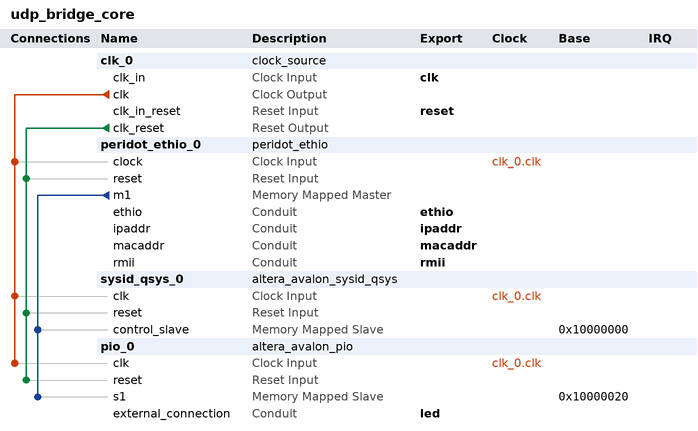
[diagram p0: system contents]
# Platform Designer (Qsys) system udp_bridge_core, Cyclone IV E EP4CE6E22C8
# Parameters at their usual value, and those the tool derives, are not listed.
package require -exact qsys 22.1
create_system udp_bridge_core
set_project_property DEVICE_FAMILY {Cyclone IV E}
set_project_property DEVICE EP4CE6E22C8

add_instance clk_0 clock_source 22.1
set_instance_parameter_value clk_0 clockFrequency 50000000

add_instance peridot_ethio_0 peridot_ethio 20.1
set_instance_parameter_value peridot_ethio_0 AVALONMM_FASTMODE 0
set_instance_parameter_value peridot_ethio_0 ENABLE_UDP_CHECKSUM 1
set_instance_parameter_value peridot_ethio_0 IGNORE_RXFCS_CHECK 0
set_instance_parameter_value peridot_ethio_0 IPADDR_VALUE 192.168.1.114
set_instance_parameter_value peridot_ethio_0 MACADDR_VALUE 280375448305665
set_instance_parameter_value peridot_ethio_0 MTU_SIZE 1500
set_instance_parameter_value peridot_ethio_0 PART_NAME EP4CE6E22C8
set_instance_parameter_value peridot_ethio_0 PAUSEFRAME_VALUE 65535
set_instance_parameter_value peridot_ethio_0 PAUSELESS_VALUE 0
set_instance_parameter_value peridot_ethio_0 RXFIFO_SIZE 4096
set_instance_parameter_value peridot_ethio_0 SINKFIFO_0_SIZE 2048
set_instance_parameter_value peridot_ethio_0 SINKFIFO_1_SIZE 2048
set_instance_parameter_value peridot_ethio_0 SINKFIFO_2_SIZE 2048
set_instance_parameter_value peridot_ethio_0 SINKFIFO_3_SIZE 2048
set_instance_parameter_value peridot_ethio_0 SINKFIFO_NUMBER 1
set_instance_parameter_value peridot_ethio_0 SRCFIFO_0_SIZE 2048
set_instance_parameter_value peridot_ethio_0 SRCFIFO_1_SIZE 2048
set_instance_parameter_value peridot_ethio_0 SRCFIFO_2_SIZE 2048
set_instance_parameter_value peridot_ethio_0 SRCFIFO_3_SIZE 2048
set_instance_parameter_value peridot_ethio_0 SRCFIFO_NUMBER 1
set_instance_parameter_value peridot_ethio_0 SUPPORT_HARFDUPLEX 0
set_instance_parameter_value peridot_ethio_0 SUPPORT_MEMORYHOST 1
set_instance_parameter_value peridot_ethio_0 SUPPORT_PAUSEFRAME 0
set_instance_parameter_value peridot_ethio_0 SUPPORT_SPEED_10M 0
set_instance_parameter_value peridot_ethio_0 SUPPORT_STREAMFIFO 0
set_instance_parameter_value peridot_ethio_0 TXFIFO_SIZE 4096
set_instance_parameter_value peridot_ethio_0 UDPPORT_VALUE 16241
set_instance_parameter_value peridot_ethio_0 USE_FIXED_IPADDR false
set_instance_parameter_value peridot_ethio_0 USE_FIXED_MACADDR false
set_instance_parameter_value peridot_ethio_0 USE_FIXED_PAUSE true
set_instance_parameter_value peridot_ethio_0 USE_FIXED_UDPPORT true

add_instance sysid_qsys_0 altera_avalon_sysid_qsys 22.1
set_instance_parameter_value sysid_qsys_0 id 1923088386

add_instance pio_0 altera_avalon_pio 22.1
set_instance_parameter_value pio_0 direction Output
set_instance_parameter_value pio_0 width 2

# connections
add_connection clk_0.clk peridot_ethio_0.clock clock
add_connection clk_0.clk pio_0.clk clock
add_connection clk_0.clk sysid_qsys_0.clk clock
add_connection clk_0.clk_reset peridot_ethio_0.reset reset
add_connection clk_0.clk_reset pio_0.reset reset
add_connection clk_0.clk_reset sysid_qsys_0.reset reset
add_connection peridot_ethio_0.m1 pio_0.s1 avalon
set_connection_parameter_value peridot_ethio_0.m1/pio_0.s1 baseAddress 0x10000020
add_connection peridot_ethio_0.m1 sysid_qsys_0.control_slave avalon
set_connection_parameter_value peridot_ethio_0.m1/sysid_qsys_0.control_slave baseAddress 0x10000000

# exported interfaces
add_interface clk clock sink
set_interface_property clk EXPORT_OF clk_0.clk_in
add_interface ethio conduit end
set_interface_property ethio EXPORT_OF peridot_ethio_0.ethio
add_interface ipaddr conduit end
set_interface_property ipaddr EXPORT_OF peridot_ethio_0.ipaddr
add_interface led conduit end
set_interface_property led EXPORT_OF pio_0.external_connection
add_interface macaddr conduit end
set_interface_property macaddr EXPORT_OF peridot_ethio_0.macaddr
add_interface reset reset sink
set_interface_property reset EXPORT_OF clk_0.clk_in_reset
add_interface rmii conduit end
set_interface_property rmii EXPORT_OF peridot_ethio_0.rmii

set_interconnect_requirement {$system} qsys_mm.clockCrossingAdapter HANDSHAKE
set_interconnect_requirement {$system} qsys_mm.enableEccProtection FALSE
set_interconnect_requirement {$system} qsys_mm.insertDefaultSlave FALSE
set_interconnect_requirement {$system} qsys_mm.maxAdditionalLatency 1

save_system udp_bridge_core.qsys
